# EAGLE design power (EAGLE 6.5.0)
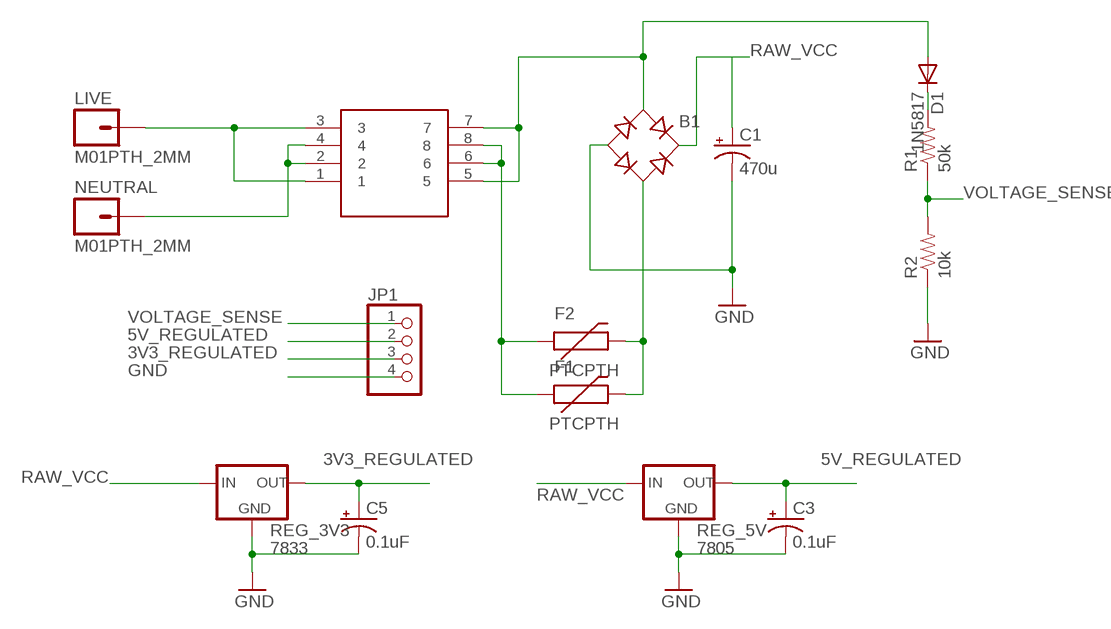
[diagram p0: schematic, sheet 1]

## Parts
B1  RB1A  [RB1A]
C1  470u  CPOL-USE3.5-8  [E3,5-8]
C3  0.1uF  10UF-25V-20%(PTH)  [CPOL-RADIAL-10UF-25V]
C5  0.1uF  10UF-25V-20%(PTH)  [CPOL-RADIAL-10UF-25V]
D1  1N5817  BAS15  [DO34-7]
F1  PTCPTH  [PTC]
F2  PTCPTH  [PTC]
JP1  PINHD-1X4  [1X04]
LIVE  M01PTH_2MM  [1X01_2MM]
NEUTRAL  M01PTH_2MM  [1X01_2MM]
R1  50k  RESISTOREZ  [AXIAL-0.3EZ]
R2  10k  RESISTOREZ  [AXIAL-0.3EZ]
REG_3V3  7833  V_REG_78XXSINK  [TO220-IGO]
REG_5V  7805  V_REG_78XXSINK  [TO220-IGO]
U$1  FP16-150  FLATPACKXFORMER  [FLATPACKXFORMER]

## Nets
3V3_REGULATED: C5.1(+) JP1.3 REG_3V3.OUT
5V_REGULATED: C3.1(+) JP1.2 REG_5V.OUT
GND: B1.- C1.- C3.2(-) C5.2(-) JP1.4 R2.P$1 REG_3V3.GND REG_5V.GND
N$1: F1.P$1 F2.P$1 U$1.6 U$1.8
N$2: B1.AC2 F1.P$2 F2.P$2
N$3: LIVE.1 U$1.1 U$1.3
N$4: D1.C R1.P$2
N$12: B1.AC1 D1.A U$1.5 U$1.7
NEUTRAL_IN: NEUTRAL.1 U$1.2 U$1.4
RAW_VCC: B1.+ C1.+ REG_3V3.IN REG_5V.IN
VOLTAGE_SENSE: JP1.1 R1.P$1 R2.P$2

## Library data of the parts
B1 = rectifier:RB1A: RECTIFIER 1 A
C1 = rcl:CPOL-US: POLARIZED CAPACITOR, American symbol
C3 C5 = SparkFun-Capacitors:10UF-25V-20%(PTH): CAP-08440; PROD_ID: CAP-08440
D1 = diode:BAS15: DIODE high speed
F1 F2 = SparkFun-PowerIC:PTC: Resettable Fuse PTC Resettable Fuse. Spark Fun Electronics SKU : COM-08357
JP1 = pinhead:PINHD-1X4: PIN HEADER
LIVE NEUTRAL = SparkFun:M01: Header 1 Standard 1-pin 0.1" header. Use with straight break away headers (SKU : PRT-00116), right angle break away headers (PRT-00553), swiss pins (PRT-00743), machine pins (PRT-00117), and female headers (PRT-00115).
R1 R2 = SparkFun-Passives:RESISTOR: Resistor Basic schematic elements and footprints for 0603, 1206, and PTH resistors.
REG_3V3 REG_5V = SparkFun-PowerIC:V_REG_78XX: Voltage Regulator Standard 7805 5V regulator. IGO (Input Ground Output). Spark Fun Electronics SKU : COM-00107
U$1 = flatpackxformer:FLATPACKXFORMER

## Net classes
0 default: width 0.508 mm, drill 0.508 mm, clearance 0.508 mm

## Board
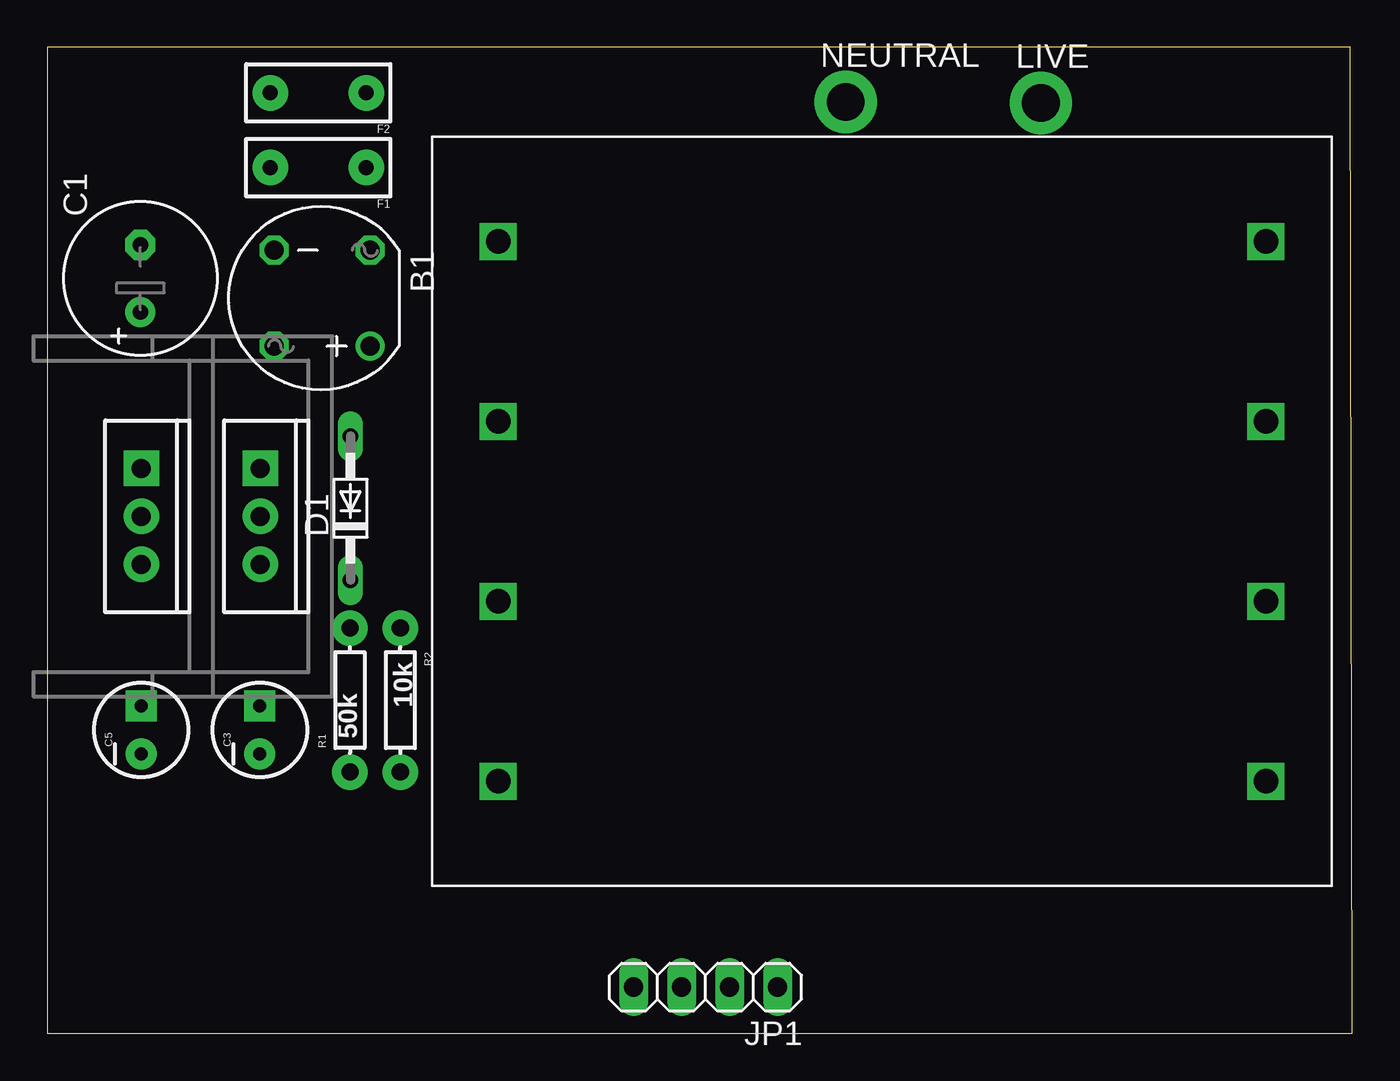
[diagram p1: board, top side]
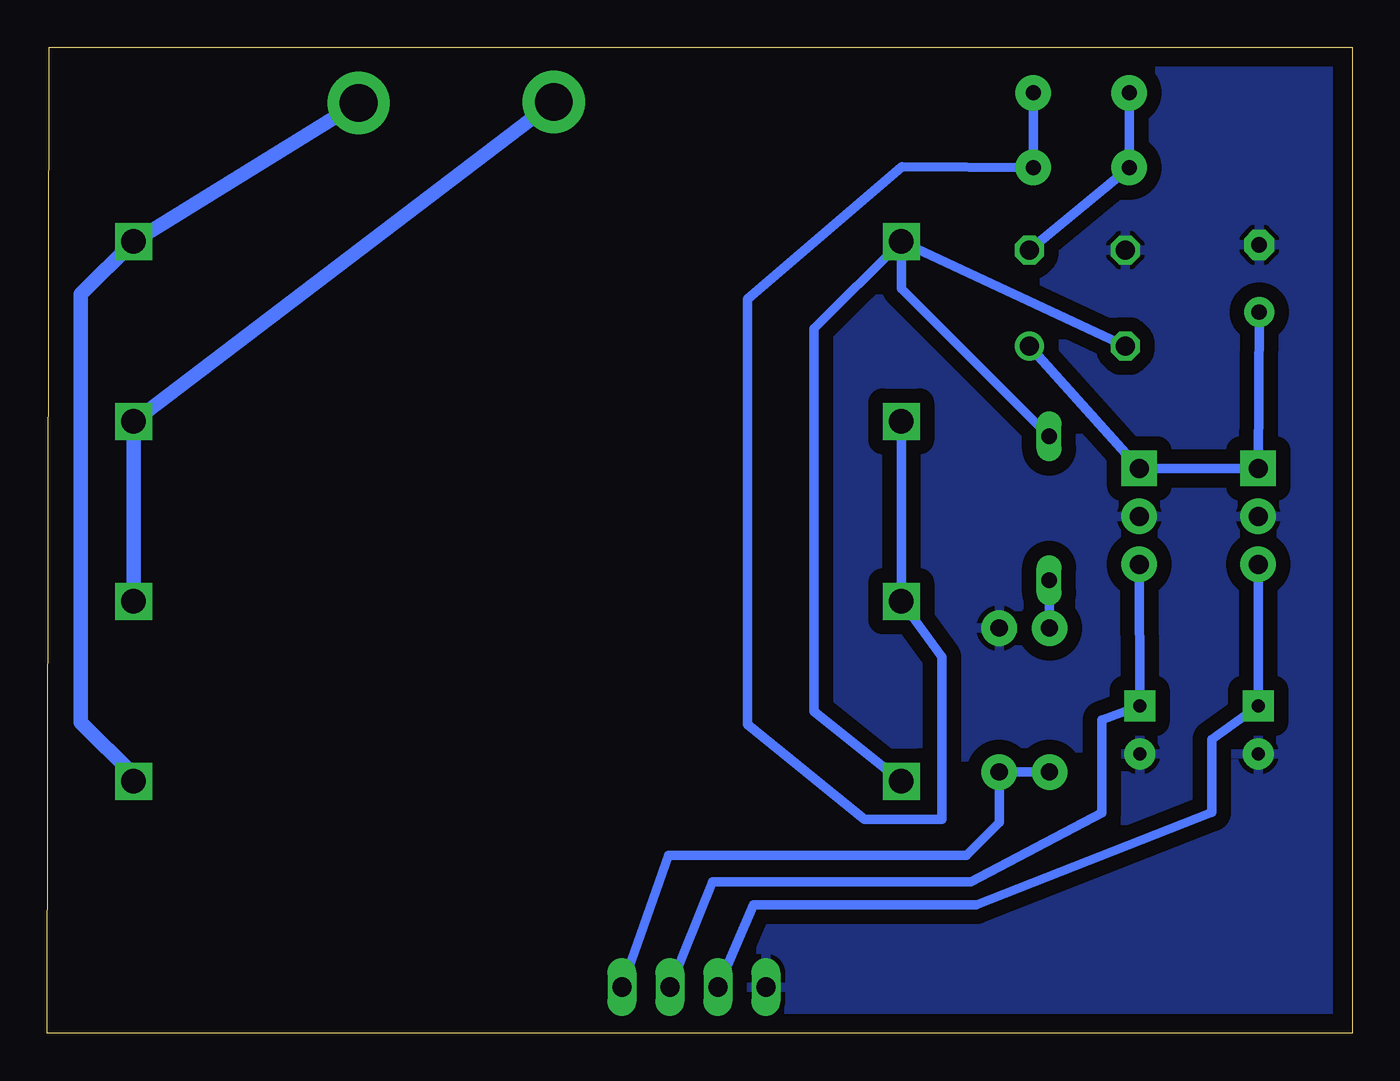
[diagram p2: board, bottom side, seen from below]

Size 69.09 x 52.22 mm. Coordinates in mm from the lower left corner, seen from the top.
Outline: 0,0 69.09,0 68.99,52.22 0,52.22 0,0
Copper layers (1*16): Top 0.035mm / dielectric 1.5mm / Bottom 0.035mm
Design rules "MWSEagleDesignRules2": minimum track width 13mil, minimum drill 22mil, track to track 13mil, track to pad 13mil, pad to pad 13mil, via to via 13mil, smd to smd 8mil, copper to edge 40mil, drill to drill 8mil, minimum pad ring 10mil, minimum via ring 8mil, stop-mask expansion 4mil, vias tented up to drill 0mil, thermal gap 10mil

### Footprints (pad centres in the part's own frame; a part is rotated, then mirrored left to right if it is on the bottom)
RB1A = drill 1.016: + -2.54,2.54 | drill 1.016 octagon: - 2.54,-2.54; AC1 2.54,2.54; AC2 -2.54,-2.54
E3,5-8 = drill 0.813 pad 1.6: + -1.778,0 | drill 0.813 pad 1.6 octagon: - 1.778,0
CPOL-RADIAL-10UF-25V = drill 0.7 pad 1.651 square: 1 1.27,0 | drill 0.7 pad 1.651: 2 -1.27,0
DO34-7 = drill 0.813 long: A 3.81,0; C -3.81,0
PTC = drill 0.8 pad 1.88: P$1 -2.54,0; P$2 2.54,0
1X04 = drill 1.016 long: 1 -3.81,0; 2 -1.27,0; 3 1.27,0; 4 3.81,0
1X01_2MM = drill 2 pad 3.302: 1 0,0
AXIAL-0.3EZ = drill 0.9 pad 1.88: P$1 -3.81,0; P$2 3.81,0
TO220-IGO = drill 1 pad 1.88: GND 0,0; OUT 2.54,0 | drill 1 pad 1.88 square: IN -2.54,0
FLATPACKXFORMER = drill 1.3 square: 1 -19.177,-13.335; 2 -19.177,-3.81; 3 -19.177,15.24; 4 -19.177,5.715; 5 21.463,-13.335; 6 21.463,-3.81; 7 21.463,15.24; 8 21.463,5.715

### Placement (x,y rotation side)
B1  14.55,38.93 180 top
C1  4.93,39.98 90 top
C3  11.25,16.07 90 top
C5  4.98,16.07 90 top
D1  16.05,27.81 90 top
F1  14.35,45.84 180 top
F2  14.35,49.81 180 top
JP1  34.85,2.46 180 top
LIVE  52.6,49.27 0 top
NEUTRAL  42.27,49.32 0 top
R1  16.03,17.65 90 top
R2  18.69,17.65 270 top
REG_3V3  4.98,27.38 270 top
REG_5V  11.28,27.38 270 top
U$1  45.34,28.6 180 top

### Tracks (layer width: path | path; a pad name or v marks a point on that pad's centre or on a via)
3V3_REGULATED
  Bottom 0.508: REG_3V3.OUT C5.1 7.44,15.57 7.44,11.71 19.89,6.8 31.7,6.8 JP1.3
5V_REGULATED
  Bottom 0.508: REG_5V.OUT C3.1 13.26,16.61 13.26,11.68 20.19,8.02 33.86,8.02 JP1.2
GND
  pour Bottom (isolate 0.762): 0,52.6 -0.2,-0.54 68.99,-0.54 69.37,52.6
N$1
  Bottom 0.508: U$1.6 U$1.8 21.72,19.94 21.72,11.35 25.83,11.32 32.03,16.35 32.03,38.88 23.85,45.89 F1.P$1 F2.P$1
N$2
  Bottom 0.508: F2.P$2 F1.P$2 B1.AC2
N$3
  Bottom 0.762: LIVE.1 U$1.1 67.31,39.14 67.31,16.48 64.52,13.69 U$1.3
N$4
  Bottom 0.508: R1.P$2 D1.C
N$12
  Bottom 0.508: U$1.5 28.5,37.31 28.5,17.07 U$1.7 | B1.AC1 U$1.5 | D1.A 23.88,39.44 U$1.5
NEUTRAL_IN
  Bottom 0.762: NEUTRAL.1 U$1.2 U$1.4
RAW_VCC
  Bottom 0.508: C1.+ REG_3V3.IN REG_5V.IN B1.+
VOLTAGE_SENSE
  Bottom 0.508: R1.P$1 R2.P$2 18.69,11.17 20.42,9.45 36.2,9.45 JP1.1